# EAGLE design Codec main (EAGLE 9.6.2)
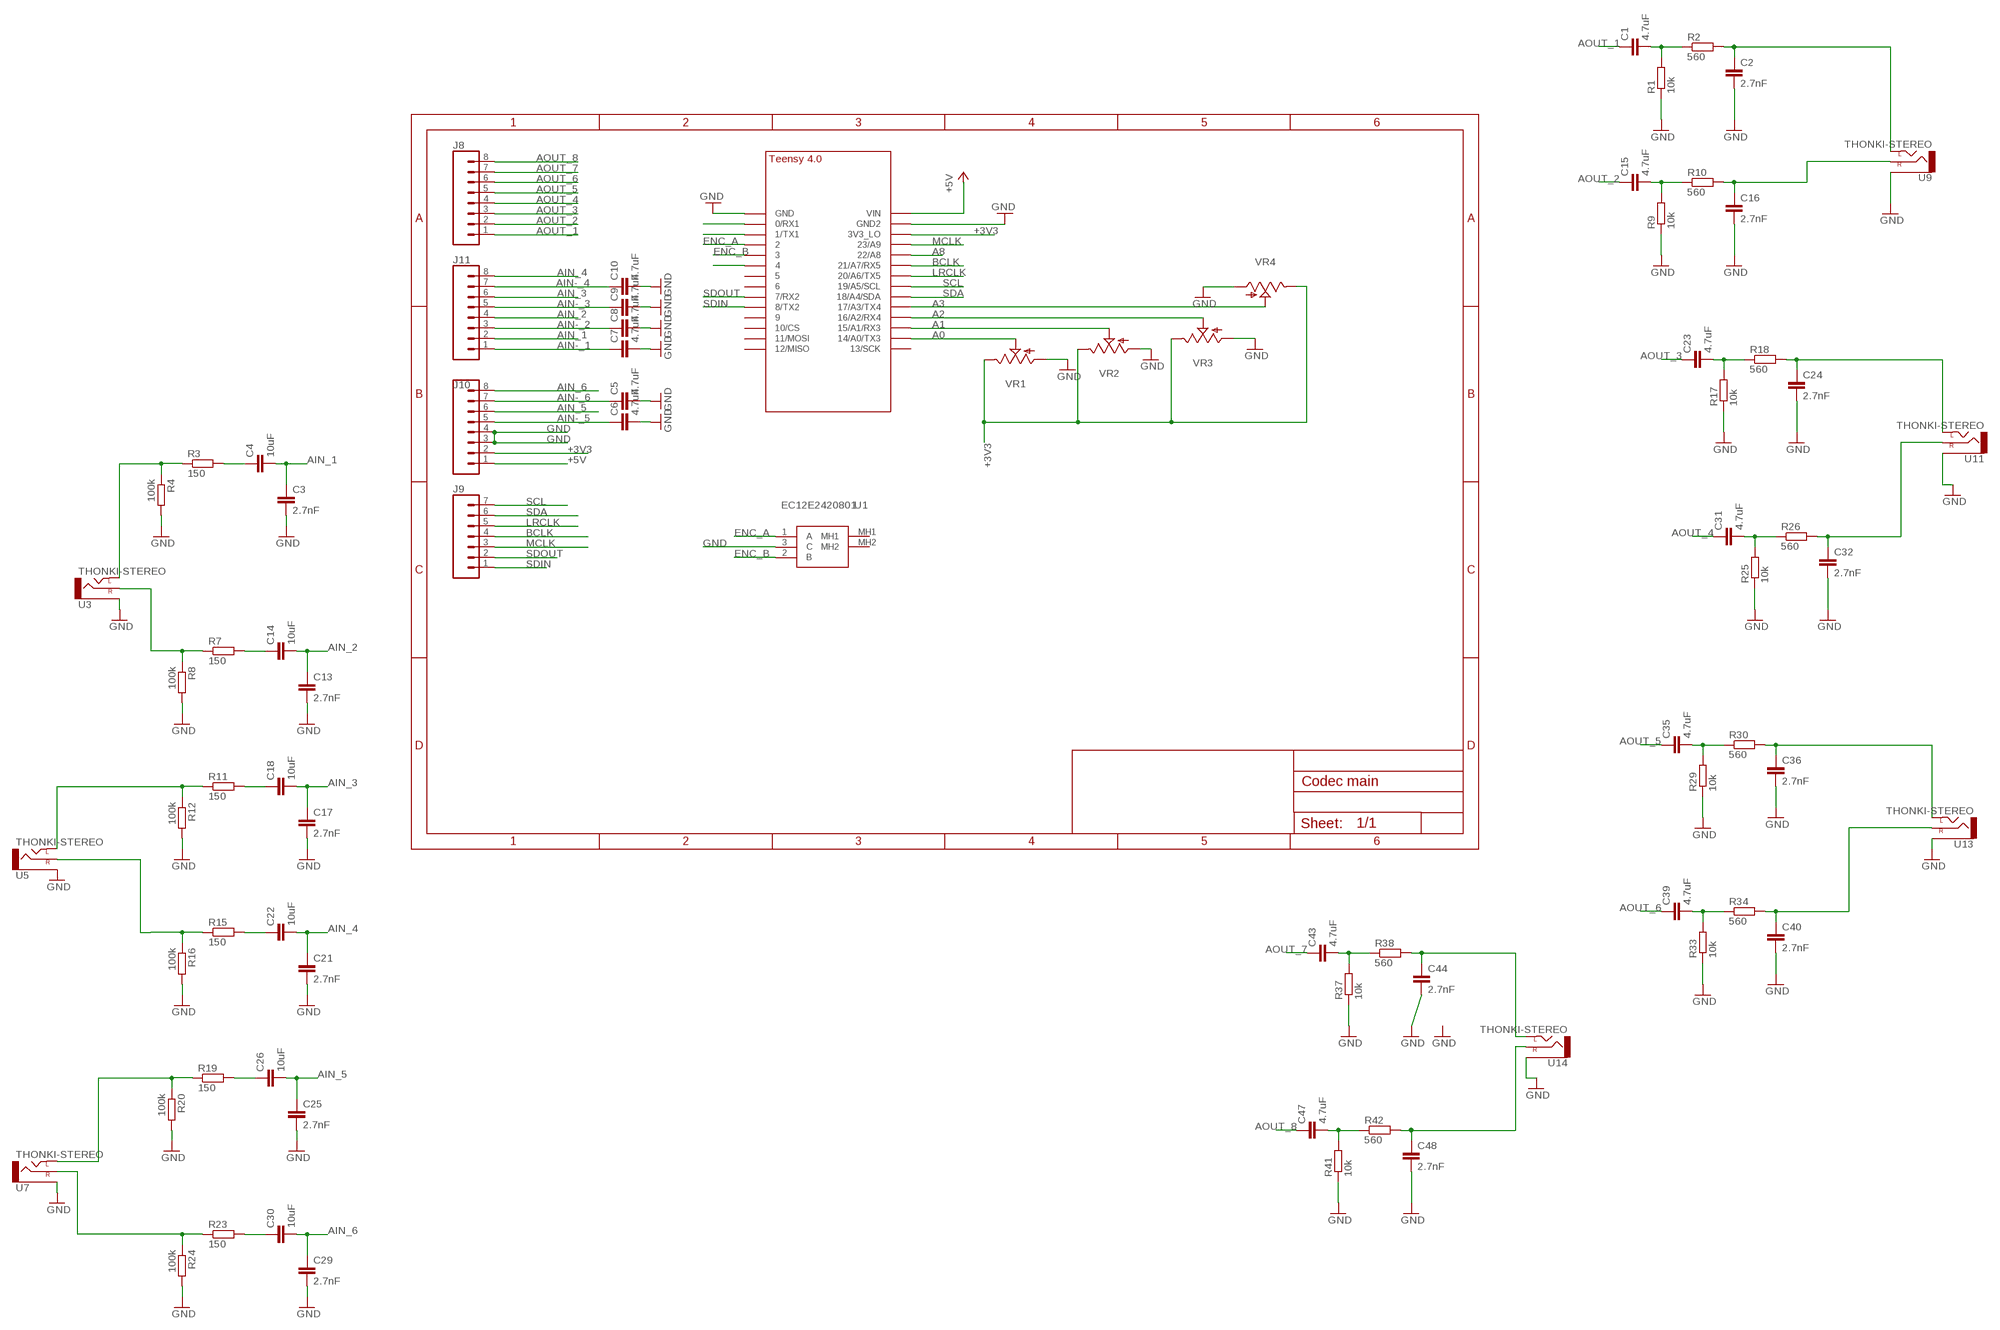
[diagram p0: schematic, sheet 1]

## Parts
C1  4.7uF  C-EUC0805  [C0805]
C2  2.7nF  C-EUC0805  [C0805]
C3  2.7nF  C-EUC0805  [C0805]
C4  10uF  C-EUC0805  [C0805]
C5  4.7uF  C-EUC0805  [C0805]
C6  4.7uF  C-EUC0805  [C0805]
C7  4.7uF  C-EUC0805  [C0805]
C8  4.7uF  C-EUC0805  [C0805]
C9  4.7uF  C-EUC0805  [C0805]
C10  4.7uF  C-EUC0805  [C0805]
C13  2.7nF  C-EUC0805  [C0805]
C14  10uF  C-EUC0805  [C0805]
C15  4.7uF  C-EUC0805  [C0805]
C16  2.7nF  C-EUC0805  [C0805]
C17  2.7nF  C-EUC0805  [C0805]
C18  10uF  C-EUC0805  [C0805]
C21  2.7nF  C-EUC0805  [C0805]
C22  10uF  C-EUC0805  [C0805]
C23  4.7uF  C-EUC0805  [C0805]
C24  2.7nF  C-EUC0805  [C0805]
C25  2.7nF  C-EUC0805  [C0805]
C26  10uF  C-EUC0805  [C0805]
C29  2.7nF  C-EUC0805  [C0805]
C30  10uF  C-EUC0805  [C0805]
C31  4.7uF  C-EUC0805  [C0805]
C32  2.7nF  C-EUC0805  [C0805]
C35  4.7uF  C-EUC0805  [C0805]
C36  2.7nF  C-EUC0805  [C0805]
C39  4.7uF  C-EUC0805  [C0805]
C40  2.7nF  C-EUC0805  [C0805]
C43  4.7uF  C-EUC0805  [C0805]
C44  2.7nF  C-EUC0805  [C0805]
C47  4.7uF  C-EUC0805  [C0805]
C48  2.7nF  C-EUC0805  [C0805]
J8  CONN_08"  [1X08]
J9  CONN_07  [1X07]
J10  CONN_08"  [1X08]
J11  CONN_08"  [1X08]
R1  10k  R-EU_R0603  [R0603]
R2  560  R-EU_M0805  [M0805]
R3  150  R-EU_M0805  [M0805]
R4  100k  R-EU_R0603  [R0603]
R7  150  R-EU_M0805  [M0805]
R8  100k  R-EU_R0603  [R0603]
R9  10k  R-EU_R0603  [R0603]
R10  560  R-EU_M0805  [M0805]
R11  150  R-EU_M0805  [M0805]
R12  100k  R-EU_R0603  [R0603]
R15  150  R-EU_M0805  [M0805]
R16  100k  R-EU_R0603  [R0603]
R17  10k  R-EU_R0603  [R0603]
R18  560  R-EU_M0805  [M0805]
R19  150  R-EU_M0805  [M0805]
R20  100k  R-EU_R0603  [R0603]
R23  150  R-EU_M0805  [M0805]
R24  100k  R-EU_R0603  [R0603]
R25  10k  R-EU_R0603  [R0603]
R26  560  R-EU_M0805  [M0805]
R29  10k  R-EU_R0603  [R0603]
R30  560  R-EU_M0805  [M0805]
R33  10k  R-EU_R0603  [R0603]
R34  560  R-EU_M0805  [M0805]
R37  10k  R-EU_R0603  [R0603]
R38  560  R-EU_M0805  [M0805]
R41  10k  R-EU_R0603  [R0603]
R42  560  R-EU_M0805  [M0805]
U1  EC12E2420801  [EC12E2420801]
U3  THONKI-STEREO  [WQP-PJ366ST_JACK]
U5  THONKI-STEREO  [WQP-PJ366ST_JACK]
U7  THONKI-STEREO  [WQP-PJ366ST_JACK]
U9  THONKI-STEREO  [WQP-PJ366ST_JACK]
U11  THONKI-STEREO  [WQP-PJ366ST_JACK]
U13  THONKI-STEREO  [WQP-PJ366ST_JACK]
U14  THONKI-STEREO  [WQP-PJ366ST_JACK]
U$1  TEENSY_4.0  [TEENSY_4.0]
VR1  9MM_SNAP-IN_POT_  [9MM_SNAP-IN_POT]
VR2  9MM_SNAP-IN_POT_  [9MM_SNAP-IN_POT]
VR3  9MM_SNAP-IN_POT_  [9MM_SNAP-IN_POT]
VR4  9MM_SNAP-IN_POT_  [9MM_SNAP-IN_POT]

## Nets
+3V3: J10.2 U$1.3V3_LO VR1.3(E) VR2.3(E) VR3.3(E) VR4.3(E)
+5V: J10.1 U$1.VIN
A0: U$1.14/A0(14/A0/TX3) VR1.2(S)
A1: U$1.15/A1(15/A1/RX3) VR2.2(S)
A2: U$1.16/A2(16/A2/RX4) VR3.2(S)
A3: U$1.17/A3(17/A3/TX4) VR4.2(S)
A8: U$1.22/A8
AIN-_1: C7.1 J11.1
AIN-_2: C8.1 J11.3
AIN-_3: C9.1 J11.5
AIN-_4: C10.1 J11.7
AIN-_5: C6.1 J10.5
AIN-_6: C5.1 J10.7
AIN_1: C3.1 C4.2 J11.2
AIN_2: C13.1 C14.2 J11.4
AIN_3: C17.1 C18.2 J11.6
AIN_4: C21.1 C22.2 J11.8
AIN_5: C25.1 C26.2 J10.6
AIN_6: C29.1 C30.2 J10.8
AOUT_1: C1.1 J8.1
AOUT_2: C15.1 J8.2
AOUT_3: C23.1 J8.3
AOUT_4: C31.1 J8.4
AOUT_5: C35.1 J8.5
AOUT_6: C39.1 J8.6
AOUT_7: C43.1 J8.7
AOUT_8: C47.1 J8.8
BCLK: J9.4 U$1.21/A7(21/A7/RX5)
ENC_A: U1.1(A) U$1.2
ENC_B: U1.2(B) U$1.3/CANTX
GND: C2.2 C3.2 C5.2 C6.2 C7.2 C8.2 C9.2 C10.2 C13.2 C16.2 C17.2 C21.2 C24.2 C25.2 C29.2 C32.2 C36.2 C40.2 C44.2 C48.2 J10.3 J10.4 R1.1 R4.2 R8.2 R9.1 R12.2 R16.2 R17.1 R20.2 R24.2 R25.1 R29.1 R33.1 R37.1 R41.1 U1.3(C) U3.P$3_SLEEVE(SLEEVE) U5.P$3_SLEEVE(SLEEVE) U7.P$3_SLEEVE(SLEEVE) U9.P$3_SLEEVE(SLEEVE) U11.P$3_SLEEVE(SLEEVE) U13.P$3_SLEEVE(SLEEVE) U14.P$3_SLEEVE(SLEEVE) U$1.GND U$1.GND2 VR1.1(A) VR2.1(A) VR3.1(A) VR4.1(A)
LRCLK: J9.5 U$1.20/A6(20/A6/TX5)
MCLK: J9.3 U$1.23/A9
N$1: C1.2 R1.2 R2.1
N$4: C2.1 R2.2 U9.P$1_TIP(LEFT)
N$5: C4.1 R3.2
N$6: U$1.4/CANRX
N$7: R7.1 R8.1 U3.P$2_SWITCH(RIGHT)
N$8: C14.1 R7.2
N$9: C15.2 R9.2 R10.1
N$10: R3.1 R4.1 U3.P$1_TIP(LEFT)
N$11: C16.1 R10.2 U9.P$2_SWITCH(RIGHT)
N$12: R11.1 R12.1 U5.P$1_TIP(LEFT)
N$13: C18.1 R11.2
N$15: U$1.0/RX(0/RX1)
N$17: R15.1 R16.1 U5.P$2_SWITCH(RIGHT)
N$18: C22.1 R15.2
N$19: C23.2 R17.2 R18.1
N$20: C24.1 R18.2 U11.P$1_TIP(LEFT)
N$21: U$1.1/TX(1/TX1)
N$22: R19.1 R20.1 U7.P$1_TIP(LEFT)
N$24: C26.1 R19.2
N$27: R23.1 R24.1 U7.P$2_SWITCH(RIGHT)
N$28: C30.1 R23.2
N$29: C31.2 R25.2 R26.1
N$30: C32.1 R26.2 U11.P$2_SWITCH(RIGHT)
N$33: C35.2 R29.2 R30.1
N$34: C36.1 R30.2 U13.P$1_TIP(LEFT)
N$37: C39.2 R33.2 R34.1
N$38: C40.1 R34.2 U13.P$2_SWITCH(RIGHT)
N$41: C43.2 R37.2 R38.1
N$42: C44.1 R38.2 U14.P$1_TIP(LEFT)
N$45: C47.2 R41.2 R42.1
N$46: C48.1 R42.2 U14.P$2_SWITCH(RIGHT)
SCL: J9.7 U$1.19/A5/SCL
SDA: J9.6 U$1.18/A4/SDA
SDIN: J9.1 U$1.8(8/TX2)
SDOUT: J9.2 U$1.7(7/RX2)
Unconnected: U1.MH1 U1.MH2 U$1.5 U$1.6 U$1.9/CS U$1.10/CS U$1.11/MOSI U$1.12/MISO U$1.13/SCK

## Library data of the parts
C1-C10 C13-C18 C21-C26 C29-C32 C35 C36 C39 C40 C43 C44 C47 C48 = rcl:C-EU: CAPACITOR, European symbol; SPICEPREFIX: C
J8 J10 J11 = SparkFun-Connectors:CONN_08: Multi connection point. Often used as Generic Header-pin footprint for 0.1 inch spaced/style header connections On any of the 0.1 inch spaced packages, you can populate with these: Break Away Headers - Straight <https://www.sparkfun.com/products/116> (PRT-00116) Break Away Male Headers - Right Angle <https://www.sparkfun.com/products/553> (PRT-00553) Female Headers <https://www.sparkfun.com/products/115> (PRT-00115) Break Away Headers - Machine Pin <https://www.sparkfun.com/products/117> (PRT-00117) Break Away Female Headers - Swiss Machine Pin <https://www.sparkfun.com/products/743> (PRT-00743) Arduino Stackable Header - 8 Pin <https://www.sparkfun.com/products/9279> (PRT-09279) For SCREWTERMINALS and SPRING TERMINALS visit here: Screw Terimnals on SparkFun.com <https://www.sparkfun.com/search/results?term=Screw+Terminals> (5mm/3.5mm/2.54mm spacing) This device is also useful as a general connection point to wire up your design to another part of your project. Our various solder wires solder well into these plated through hole pads. Hook-Up Wire - Assortment (Stranded, 22 AWG) <https://www.sparkfun.com/products/11375> (PRT-11375) Hook-Up Wire - Assortment (Solid Core, 22 AWG) <https://www.sparkfun.com/products/11367> (PRT-11367) View the entire wire category on our website here <https://www.sparkfun.com/categories/141> Special notes: Molex polarized connector foot print use with SKU : PRT-08231 with associated crimp pins and housings. 1MM SMD Version SKU: PRT-10208 NOTES ON THE VARIANTS LOCK and LOCK_LONGPADS... This footprint was designed to help hold the alignment of a through-hole component (i.e. 6-pin header) while soldering it into place. You may notice that each hole has been shifted either up or down by 0.005 of an inch from it's more standard position (which is a perfectly straight line). This slight alteration caused the pins (the squares in the middle) to touch the edges of the holes. Because they are alternating, it causes a "brace" to hold the component in place. 0.005 has proven to be the perfect amount of "off-center" position when using our standard breakaway headers. Although looks a little odd when you look at the bare footprint, once you have a header in there, the alteration is very hard to notice. Also,if you push a header all the way into place, it is covered up entirely on the bottom side.; PROD_ID: CONN-08438
J9 = SparkFun-Connectors:CONN_07: Multi connection point. Often used as Generic Header-pin footprint for 0.1 inch spaced/style header connections On any of the 0.1 inch spaced packages, you can populate with these: Break Away Headers - Straight <https://www.sparkfun.com/products/116> (PRT-00116) Break Away Male Headers - Right Angle <https://www.sparkfun.com/products/553> (PRT-00553) Female Headers <https://www.sparkfun.com/products/115> (PRT-00115) Break Away Headers - Machine Pin <https://www.sparkfun.com/products/117> (PRT-00117) Break Away Female Headers - Swiss Machine Pin <https://www.sparkfun.com/products/743> (PRT-00743) For SCREWTERMINALS and SPRING TERMINALS visit here: Screw Terimnals on SparkFun.com <https://www.sparkfun.com/search/results?term=Screw+Terminals> (5mm/3.5mm/2.54mm spacing) This device is also useful as a general connection point to wire up your design to another part of your project. Our various solder wires solder well into these plated through hole pads. Hook-Up Wire - Assortment (Stranded, 22 AWG) <https://www.sparkfun.com/products/11375> (PRT-11375) Hook-Up Wire - Assortment (Solid Core, 22 AWG) <https://www.sparkfun.com/products/11367> (PRT-11367) View the entire wire category on our website here <https://www.sparkfun.com/categories/141> Special notes: Molex polarized connector foot print use with SKU : PRT-08231 with associated crimp pins and housings. 1MM SMD Version SKU: PRT-10208 NOTES ON THE VARIANTS LOCK and LOCK_LONGPADS... This footprint was designed to help hold the alignment of a through-hole component (i.e. 6-pin header) while soldering it into place. You may notice that each hole has been shifted either up or down by 0.005 of an inch from it's more standard position (which is a perfectly straight line). This slight alteration caused the pins (the squares in the middle) to touch the edges of the holes. Because they are alternating, it causes a "brace" to hold the component in place. 0.005 has proven to be the perfect amount of "off-center" position when using our standard breakaway headers. Although looks a little odd when you look at the bare footprint, once you have a header in there, the alteration is very hard to notice. Also,if you push a header all the way into place, it is covered up entirely on the bottom side.
R1-R4 R7-R12 R15-R20 R23-R26 R29 R30 R33 R34 R37 R38 R41 R42 = rcl:R-EU_: RESISTOR, European symbol; SPICEPREFIX: R
U1 = MusicThingModular:EC12E2420801: Alps 24 Pulse Incremental Mechanical Rotary Encoder with a 6 mm Flat Shaft (Not Indexed), Through Hole Source: Datasheet <https://www.alps.com/prod/info/E/HTML/Encoder/Incremental/EC12E/EC12E2420801.html>; DESCRIPTION: Alps 24 Pulse Incremental Mechanical Rotary Encoder with a 6 mm Flat Shaft (Not Indexed), Through Hole; HEIGHT: 25mm; MANUFACTURER_NAME: ALPS; MANUFACTURER_PART_NUMBER: EC12E2420801; MOUSER_PART_NUMBER: 688-EC12E2420801; MOUSER_PRICE-STOCK: https://www.mouser.co.uk/ProductDetail/ALPS/EC12E2420801?qs=m0BA540hBPdaLIy4F3c5Mg%3D%3D
U3 U5 U7 U9 U11 U13 U14 = MusicThingModular:THONKI-STEREO: 3.5mm socket for Eurorack modular synths
U$1 = TEENSY 4.0:TEENSY_4.0
VR1-VR4 = MusicThingModular:9MM_SNAP-IN_POT: 9mm vertical snap-in pot, Alpha / Panasonic style

## Board
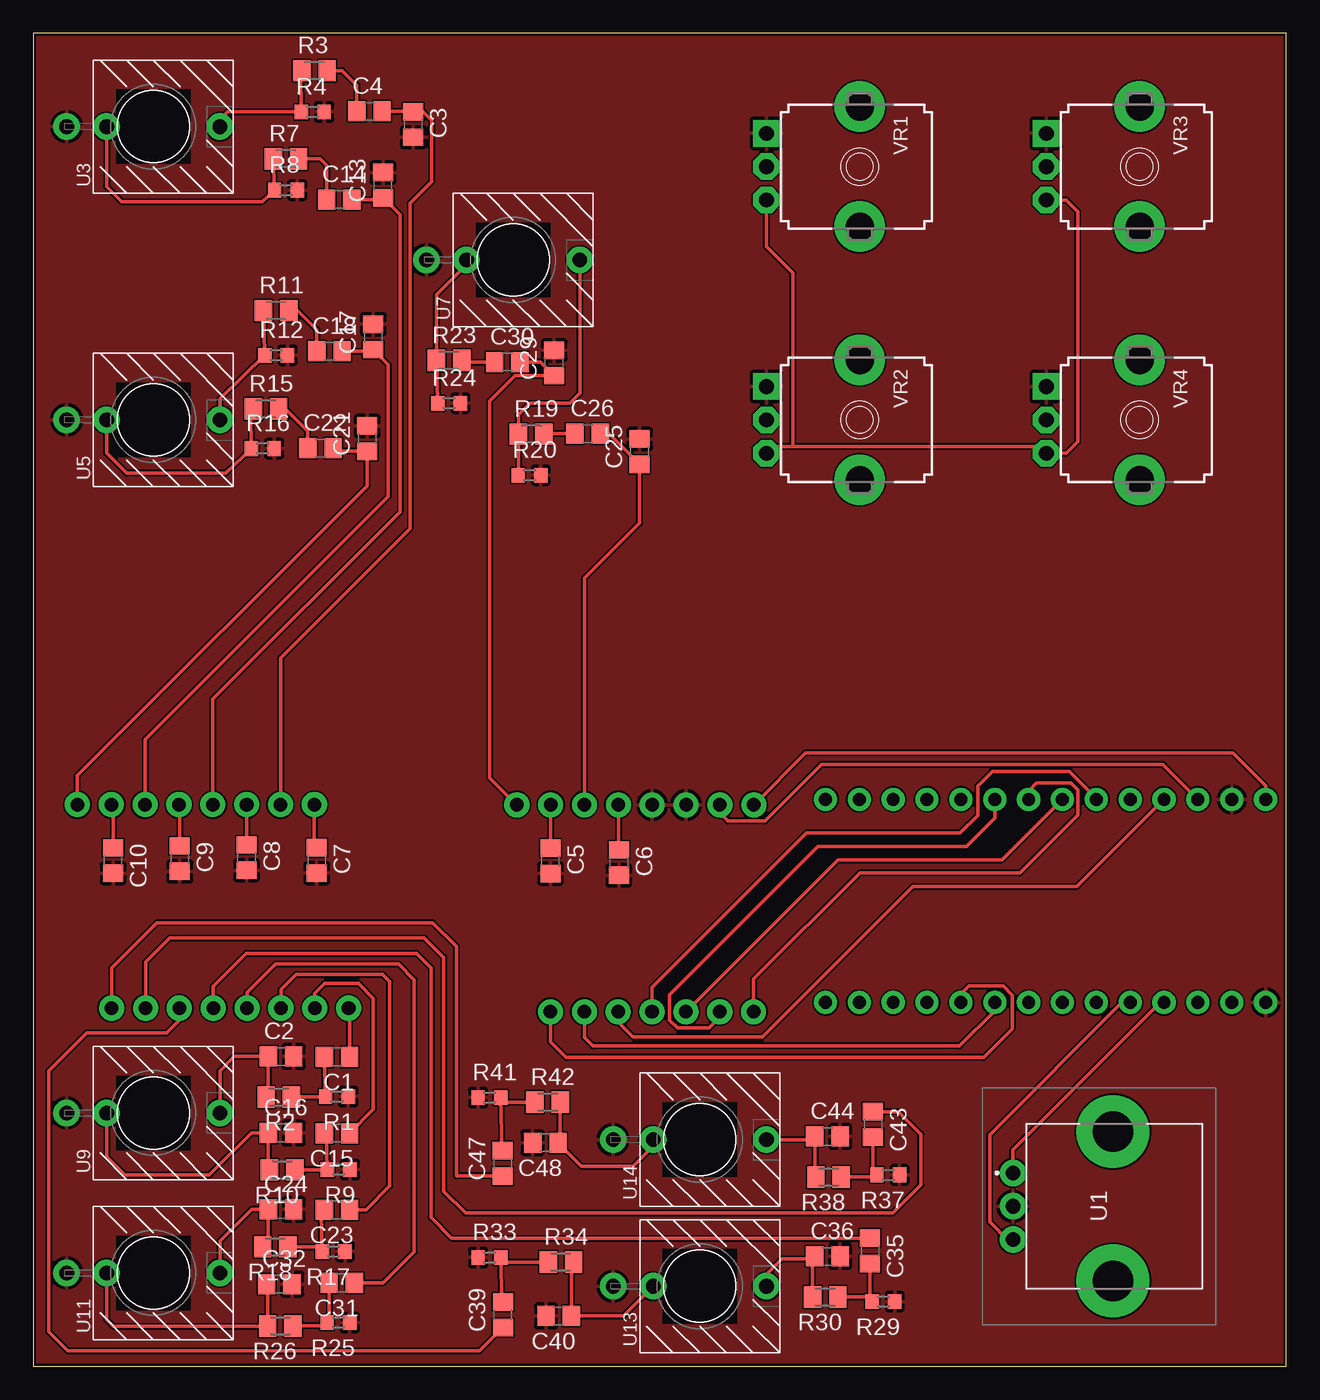
[diagram p1: board, top side]
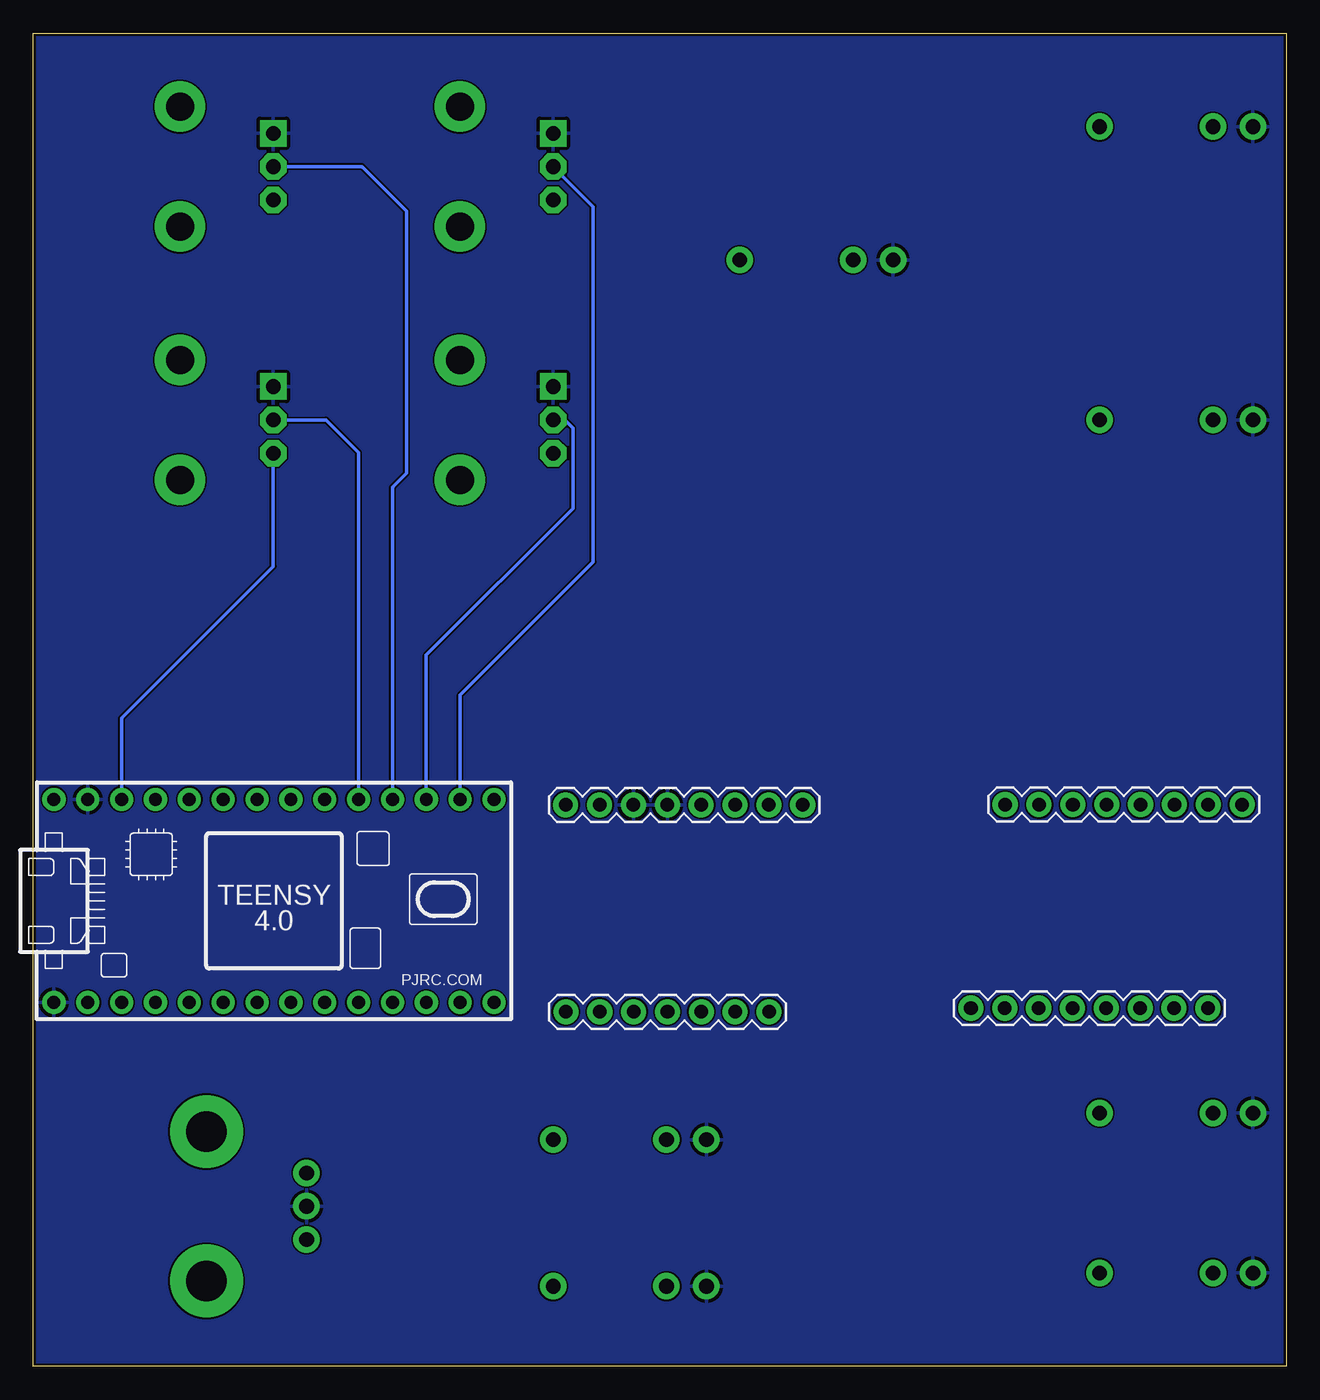
[diagram p2: board, bottom side, seen from below]

Size 94 x 100 mm. Coordinates in mm from the lower left corner, seen from the top.
Outline: 0,0 94,0 94,100 0,100 0,0
Copper layers (1*16): Top 0.035mm / dielectric 1.6mm / Bottom 0.035mm
Design rules "jlcpcb-2layers": minimum track width 5mil, minimum drill 0.3mm, track to track 5mil, track to pad 5mil, pad to pad 5mil, via to via 5mil, smd to smd 5mil, copper to edge 0.2mm, drill to drill 6mil, minimum pad ring 10mil, minimum via ring 3mil, stop-mask expansion 4mil, vias tented up to drill 0mil, thermal gap 10mil

### Footprints (pad centres in the part's own frame; a part is rotated, then mirrored left to right if it is on the bottom)
C0805 = smd 1.3 x 1.5: 1 -0.95,0; 2 0.95,0
1X08 = drill 1.016 pad 1.88: 1 0,0; 2 2.54,0; 3 5.08,0; 4 7.62,0; 5 10.16,0; 6 12.7,0; 7 15.24,0; 8 17.78,0
1X07 = drill 1.016 pad 1.88: 1 0,0; 2 2.54,0; 3 5.08,0; 4 7.62,0; 5 10.16,0; 6 12.7,0; 7 15.24,0
R0603 = smd 1 x 1.1: 1 -0.85,0; 2 0.85,0
M0805 = smd 1.3 x 1.6: 1 -0.95,0; 2 0.95,0
EC12E2420801 = drill 1.1 pad 1.65: 1 -2.5,-7.5; 2 2.5,-7.5; 3 0,-7.5 | drill 3.041 pad 4.562: MH1 -5.6,0; MH2 5.6,0
WQP-PJ366ST_JACK = drill 1.1: P$1_TIP 0,5; P$2_SWITCH 0,-3.5; P$3_SLEEVE 0,-6.5
TEENSY_4.0 = drill 0.965: 0/RX -13.97,-7.62; 1/TX -11.43,-7.62; 2 -8.89,-7.62; 3/CANTX -6.35,-7.62; 3V3_LO -11.43,7.62; 4/CANRX -3.81,-7.62; 5 -1.27,-7.62; 6 1.27,-7.62; 7 3.81,-7.62; 8 6.35,-7.62; 9/CS 8.89,-7.62; 10/CS 11.43,-7.62; 11/MOSI 13.97,-7.62; 12/MISO 16.51,-7.62; 13/SCK 16.51,7.62; 14/A0 13.97,7.62; 15/A1 11.43,7.62; 16/A2 8.89,7.62; 17/A3 6.35,7.62; 18/A4/SDA 3.81,7.62; 19/A5/SCL 1.27,7.62; 20/A6 -1.27,7.62; 21/A7 -3.81,7.62; 22/A8 -6.35,7.62; 23/A9 -8.89,7.62; GND -16.51,-7.62; GND2 -13.97,7.62; VIN -16.51,7.62
9MM_SNAP-IN_POT = drill 1.1 square: 1 -2.5,-7 | drill 1.1 octagon: 2 0,-7; 3 2.5,-7 | drill 2.1 pad 2.794: CHASSIS1 -4.5,0; CHASSIS2 4.5,0

### Placement (x,y rotation side)
C1  22.78,23.21 180 top
C2  18.59,23.23 0 top
C3  28.5,93.16 270 top
C4  25.22,94.15 0 top
C5  38.8,37.91 270 top
C6  43.94,37.78 270 top
C7  21.26,37.95 270 top
C8  16,38.16 270 top
C9  10.99,38.08 270 top
C10  5.99,37.93 270 top
C13  26.23,88.6 90 top
C14  22.95,87.53 0 top
C15  22.78,17.48 180 top
C16  18.59,17.5 0 top
C17  25.5,77.22 90 top
C18  22.22,76.15 0 top
C21  25.05,69.59 90 top
C22  21.54,68.88 0 top
C23  22.78,11.73 180 top
C24  18.59,11.76 0 top
C25  45.48,68.62 90 top
C26  41.59,69.96 0 top
C29  39.07,75.27 90 top
C30  35.55,75.34 0 top
C31  23.14,6.26 180 top
C32  18.46,6.16 0 top
C35  62.77,8.65 270 top
C36  59.59,8.23 0 top
C39  35.23,3.85 90 top
C40  39.41,3.77 180 top
C43  63.01,18.14 270 top
C44  59.59,17.23 0 top
C47  35.21,15.22 90 top
C48  38.41,16.77 180 top
J8  23.66,26.86 0 bottom
J9  38.8,26.59 180 bottom
J10  54.05,42.12 0 bottom
J11  21.09,42.13 0 bottom
R1  22.78,20.23 180 top
R2  18.41,20.2 180 top
R3  21.09,97.2 0 top
R4  20.97,94.1 0 top
R7  18.95,90.58 0 top
R8  18.95,88.23 0 top
R9  22.91,14.75 180 top
R10  18.67,14.74 180 top
R11  18.22,79.2 0 top
R12  18.22,75.85 0 top
R15  17.46,71.82 0 top
R16  17.22,68.85 0 top
R17  22.53,8.61 180 top
R18  18.16,8.96 180 top
R19  37.35,69.93 0 top
R20  37.22,66.85 0 top
R23  31.19,75.45 0 top
R24  31.19,72.25 0 top
R25  22.89,3.27 180 top
R26  18.53,3.02 180 top
R29  63.78,4.85 180 top
R30  59.41,5.2 180 top
R33  34.22,8.15 0 top
R34  39.59,7.8 0 top
R37  64.14,14.35 180 top
R38  59.67,14.2 180 top
R41  34.22,20.15 0 top
R42  38.59,19.8 0 top
U1  81,12 270 top
U3  9,93 270 top
U5  9,71 270 top
U7  36,83 270 top
U9  9,19 270 top
U11  9,7 270 top
U13  50,6 270 top
U14  50,17 270 top
U$1  75.95,34.91 0 bottom
VR1  62,90 270 top
VR2  62,71 270 top
VR3  83,90 270 top
VR4  83,71 270 top

### Tracks (layer width: path | path; a pad name or v marks a point on that pad's centre or on a via)
+3V3
  Top 0.254: U$1.3V3_LO 84.76,45.15 59.15,45.15 54.9,40.9 52.1,40.9 51.51,41.49 J10.2 | VR3.3 77.5,87.5 78.36,86.64 78.36,69.36 77.5,68.5 VR4.3 75.5,69 57,69 | 57,69 57,82 55,84 VR1.3 | VR2.3 55,68.75 55.25,69 57,69
  Bottom 0.254: U$1.3V3_LO 87.38,48.62 76,60 VR4.3
+5V
  Top 0.254: U$1.VIN 92.46,43.54 90,46 57.94,46 J10.1
A0
  Bottom 0.254: U$1.14/A0 61.98,50.36 52,60.34 52,87 VR1.2
A1
  Bottom 0.254: U$1.15/A1 64.52,53.34 53.51,64.35 53.51,70.4 54.11,71 VR2.2
A2
  Bottom 0.254: U$1.16/A2 67.06,65.94 66,67 66,86.67 69.33,90 VR3.2
A3
  Bottom 0.254: U$1.17/A3 69.6,68.55 72.05,71 VR4.2
AIN-_1
  Top 0.254: J11.1 21.09,39.08 C7.1
AIN-_2
  Top 0.254: J11.3 C8.1
AIN-_3
  Top 0.254: J11.5 10.99,42.07 C9.1
AIN-_4
  Top 0.254: J11.7 5.99,41.99 C10.1
AIN-_5
  Top 0.254: J10.5 43.89,38.78 C6.1
AIN-_6
  Top 0.254: J10.7 38.81,38.87 C5.1
AIN_1
  Top 0.254: C4.2 28.35,94.15 28.39,94.11 C3.1 29.25,94.11 29.87,93.49 29.87,88.87 28.25,87.25 28.25,62.84 18.55,53.13 J11.2
AIN_2
  Top 0.254: C14.2 26.11,87.53 C13.1 27.5,86.38 27.5,64.09 13.47,50.06 J11.4
AIN_3
  Top 0.254: J11.6 8.39,47.01 26.64,65.26 26.64,75.14 C17.1 25.73,76.27 25.85,76.15 C18.2
AIN_4
  Top 0.254: J11.8 3.31,44.31 25.05,66.05 C21.1 22.73,68.64 C22.2
AIN_5
  Top 0.254: C26.2 43.19,69.96 C25.1 45.48,63.24 41.35,59.12 J10.6
AIN_6
  Top 0.254: C30.2 38.05,75.34 C29.1 36.15,74.32 34.24,72.41 34.24,44.15 J10.8
AOUT_1
  Top 0.254: C1.1 23.73,26.79 J8.1
AOUT_2
  Top 0.254: J8.2 21.12,27.96 21.86,28.7 24.4,28.7 25.51,27.59 25.51,19.26 C15.1
AOUT_3
  Top 0.254: J8.3 18.58,28.26 19.73,29.41 26.2,29.41 26.73,28.87 26.73,13.51 24.95,11.73 C23.1
AOUT_4
  Top 0.254: J8.4 16.04,28.04 18.18,30.18 27.4,30.18 28.57,29 28.57,8.58 26.25,6.26 C31.1
AOUT_5
  Top 0.254: J8.5 13.5,28.5 15.98,30.98 28.75,30.98 29.84,29.89 29.84,11.16 31.4,9.6 C35.1
AOUT_6
  Top 0.254: J8.6 10.96,25.96 10,25 4,25 1.14,22.14 1.14,2.59 2.59,1.14 33.46,1.14 C39.1
AOUT_7
  Top 0.254: J8.7 8.42,30.32 10.23,32.13 29.34,32.13 30.78,30.68 30.78,13.12 32.41,11.49 64.49,11.49 66.6,13.6 66.6,17.4 64.91,19.09 C43.1
AOUT_8
  Top 0.254: C47.1 31.75,14.27 31.75,31.5 29.97,33.27 9.27,33.27 5.88,29.88 J8.8
BCLK
  Top 0.254: U$1.21/A7 79.76,42.58 77.72,44.61 71.94,44.61 70.86,43.53 70.86,41.34 69.52,40 58,40 46.42,28.42 J9.4
ENC_A
  Top 0.254: U1.1 73.5,16.23 84.56,27.29 U$1.2
ENC_B
  Top 0.254: U1.2 73.08,9.5 71.75,10.83 71.75,17.37 81.68,27.29 U$1.3/CANTX
GND
  pour Top: 0,100 94,100 94,0 0,0
  pour Bottom: 0,100 95,100 95,0 0,0
LRCLK
  Top 0.254: J9.5 60.37,38 72.69,38 U$1.20/A6
MCLK
  Top 0.254: J9.3 43.88,25.83 45,24.71 54.71,24.71 66,36 78.31,36 U$1.23/A9
N$1
  Top 0.254: R2.1 21.8,20.2 R1.2 C1.2
N$4
  Top 0.254: U9.P$1_TIP 14,22.18 15.06,23.23 C2.1 17.64,20.37 R2.2
N$5
  Top 0.254: R3.2 23.19,97.2 24.27,96.12 C4.1
N$7
  Top 0.254: U3.P$2_SWITCH 5.5,88.5 6.62,87.38 17.15,87.38 R8.1 R7.1
N$8
  Top 0.254: R7.2 21.53,90.58 22,90.11 C14.1
N$9
  Top 0.254: R10.1 21.94,14.74 R9.2 21.96,17.35 C15.2
N$10
  Top 0.254: U3.P$1_TIP 14,93.54 14.56,94.1 R4.1 20.02,97.07 R3.1
N$11
  Top 0.254: R10.2 17.64,14.82 C16.1 16.36,17.5 13.21,14.35 6.86,14.35 5.5,15.7 U9.P$2_SWITCH
N$12
  Top 0.254: U5.P$1_TIP 14,72.58 R12.1 R11.1
N$13
  Top 0.254: R11.2 19.85,79.2 21.27,77.78 C18.1
N$17
  Top 0.254: R15.1 16.27,71.58 R16.1 14.42,67 7,67 5.5,68.5 U5.P$2_SWITCH
N$18
  Top 0.254: C22.1 20.59,70.14 18.92,71.82 R15.2
N$19
  Top 0.254: R18.1 21.23,8.96 R17.2 21.58,11.48 C23.2
N$20
  Top 0.254: U11.P$1_TIP 14,9.39 16.36,11.76 C24.1 17.64,9.38 R18.2
N$22
  Top 0.254: R20.1 36.4,66.98 R19.1 36.4,71.4 37.25,72.25 40.25,72.25 41,73 U7.P$1_TIP
N$24
  Top 0.254: R19.2 38.33,69.96 C26.1
N$27
  Top 0.254: U7.P$2_SWITCH 32,82.5 32,82.17 30.24,80.41 R23.1 R24.1
N$28
  Top 0.254: R23.2 32.25,75.34 C30.1
N$29
  Top 0.254: R26.1 21.69,3.02 R25.2 22.2,3.53 C31.2
N$30
  Top 0.254: C32.1 17.58,6.09 R26.2 17.55,3 6,3 5.5,3.5 U11.P$2_SWITCH
N$33
  Top 0.254: R30.1 62.48,5.2 R29.2 62.77,4.9 C35.2
N$34
  Top 0.254: R30.2 58.47,8.06 | 58.47,8.06 C36.1 | U13.P$1_TIP 55,6.89 56.17,8.06 58.47,8.06
N$37
  Top 0.254: R34.1 35.52,7.8 R33.2 35.17,4.86 C39.2
N$38
  Top 0.254: R34.2 40.37,7.63 C40.1 44.27,3.77 U13.P$2_SWITCH
N$41
  Top 0.254: R38.1 63.04,14.2 R37.2 63.01,14.54 C43.2
N$42
  Top 0.254: R38.2 58.63,14.28 C44.1 58.4,17 U14.P$1_TIP
N$45
  Top 0.254: R42.1 35.52,19.8 R41.2 35.17,16.21 C47.2
N$46
  Top 0.254: R42.2 39.53,16.94 C48.1 41.13,15 45,15 46.5,16.5 U14.P$2_SWITCH
SCL
  Top 0.254: J9.7 54.04,29.04 62,37 74,37 78.36,41.36 78.36,43.24 77.84,43.76 75.27,43.76 74.68,43.16 U$1.19/A5/SCL
SDA
  Top 0.254: J9.6 51.5,26.18 50.7,25.37 48.33,25.37 47.74,25.96 47.74,27.86 58.88,39 70,39 72.14,41.14 U$1.18/A4/SDA
SDIN
  Top 0.254: J9.1 38.8,24.34 39.98,23.16 71.31,23.16 73.46,25.31 73.46,27.82 72.76,28.52 70.19,28.52 69.6,27.93 U$1.8
SDOUT
  Top 0.254: U$1.7 72.14,26.66 69.5,24.02 41.98,24.02 41.34,24.66 J9.2